# EAGLE design imu_b_03_12_2018 (EAGLE 6.6.0)
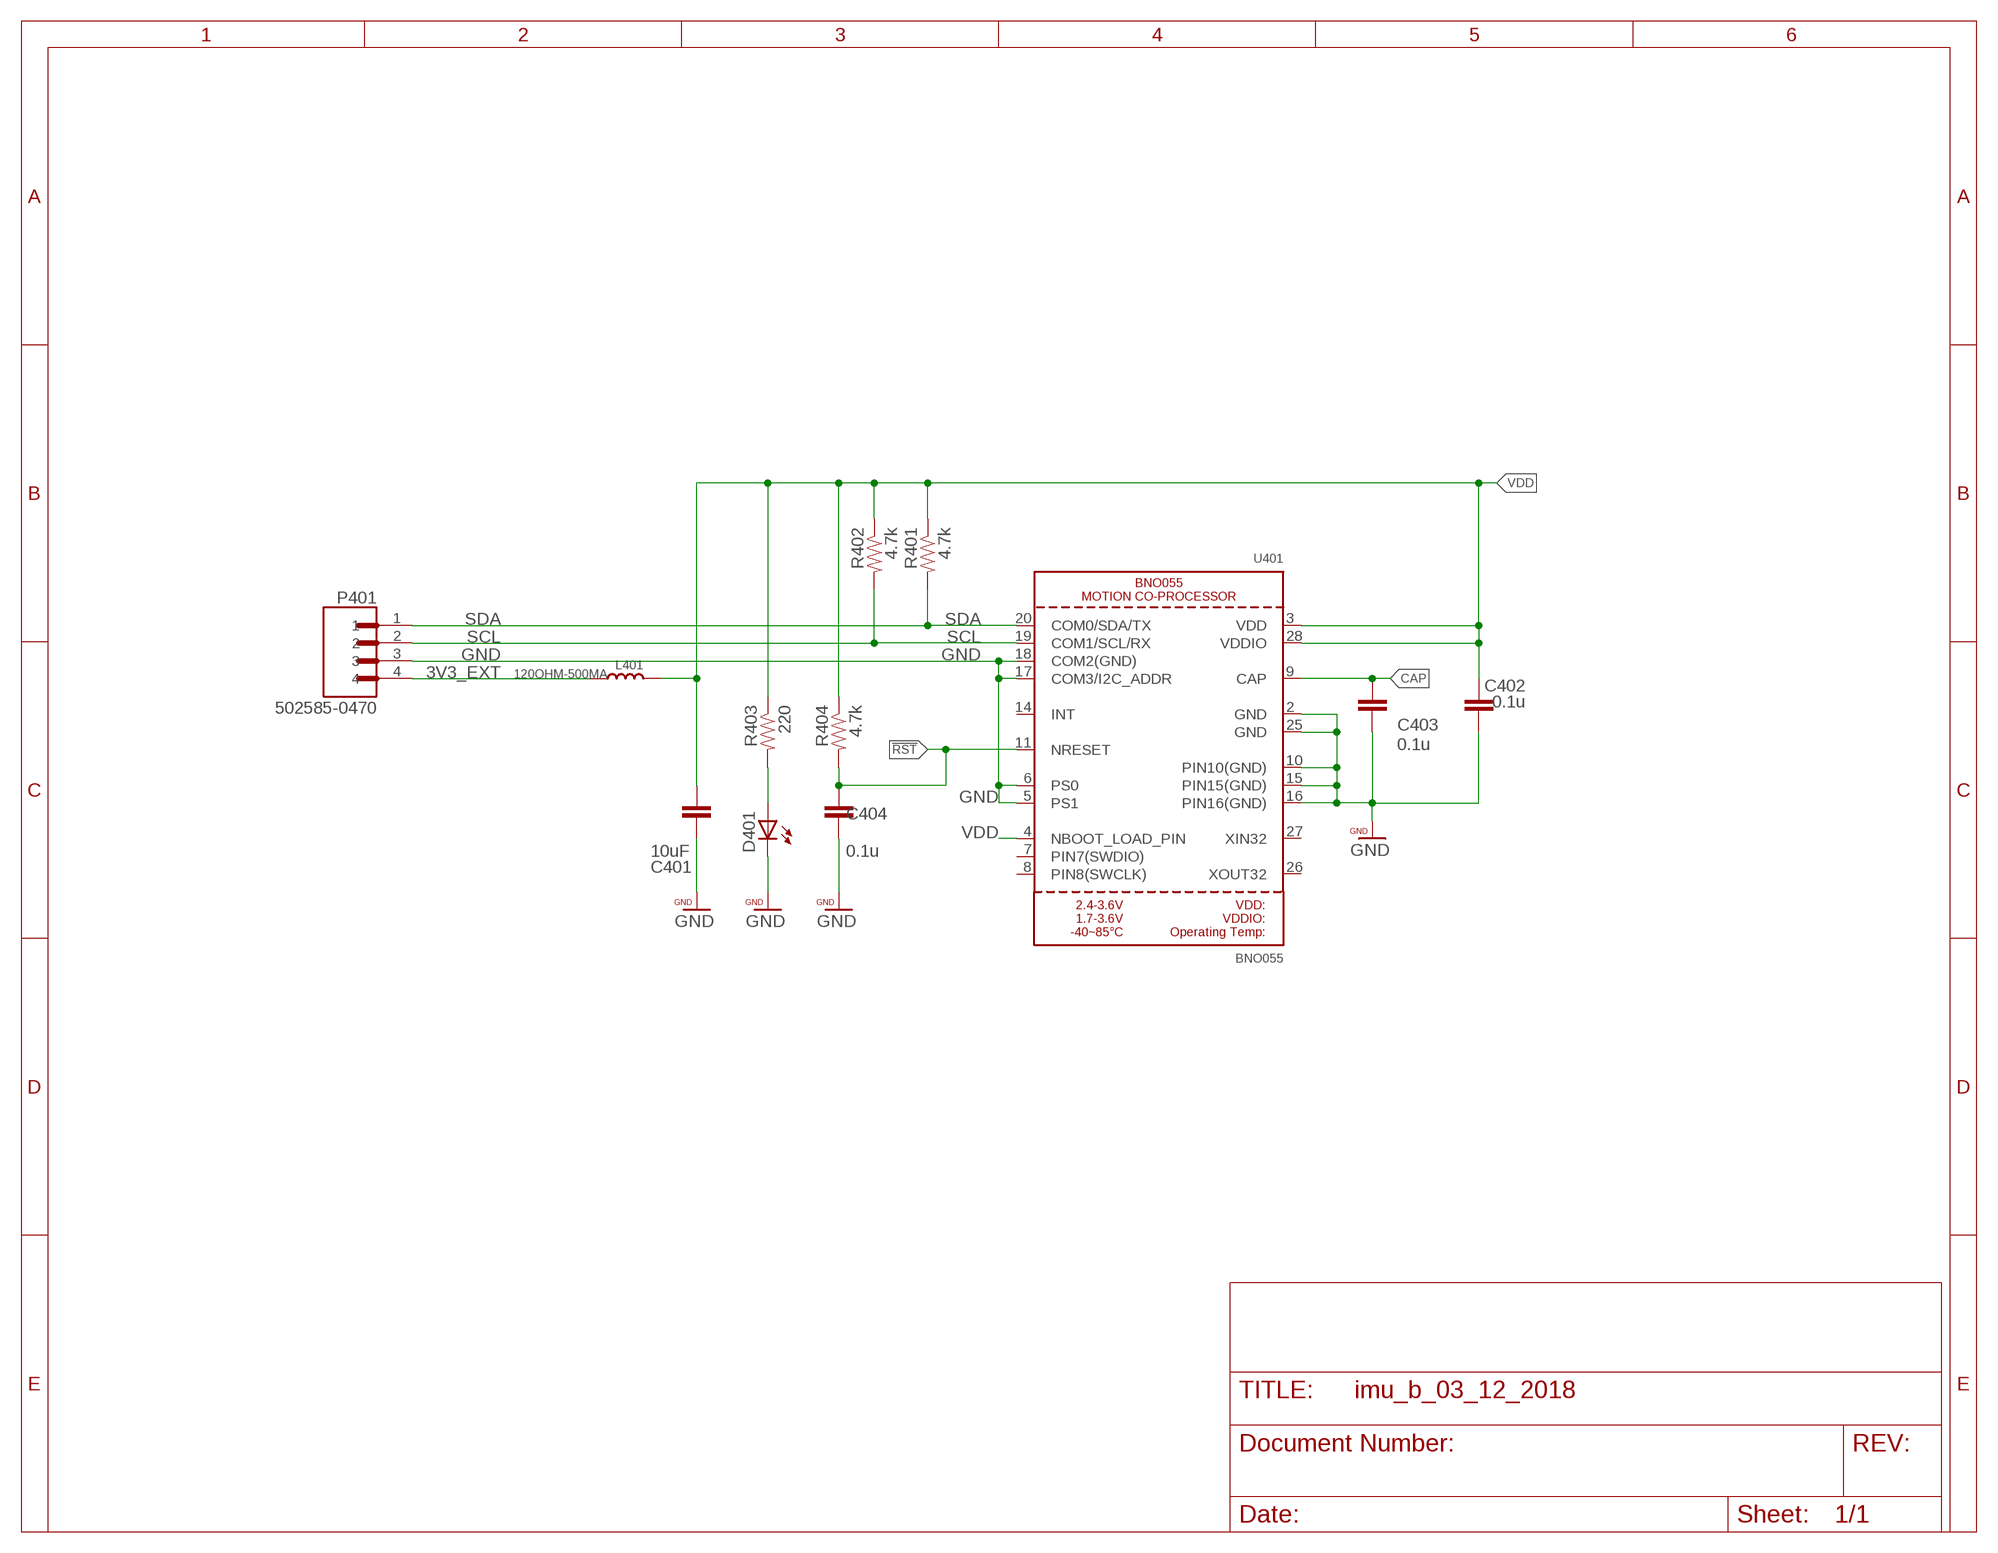
[diagram p0: schematic, sheet 1]

## Parts
C401  10uF  CAP0402-CAP  [0402-CAP]
C402  0.1u  CAP0402-CAP  [0402-CAP]
C403  0.1u  CAP0402-CAP  [0402-CAP]
C404  0.1u  CAP0402-CAP  [0402-CAP]
D401  LEDCHIP-LED0603  [CHIP-LED0603]
L401  120OHM-500MA  SMD-FERRITE-CHIP-120-OHM-500MA(0603)  [L0603]
P401  502585-0470  [MOLEX_502585-0470]
R401  4.7k  RESISTOR0402-TYP  [EIA-0402]
R402  4.7k  RESISTOR0402-TYP  [EIA-0402]
R403  220  RESISTOR0402-TYP  [EIA-0402]
R404  4.7k  RESISTOR0402-TYP  [EIA-0402]
U401  BNO055  [BNO055]

## Nets
3V3_EXT: L401.2 P401.4
!RST: C404.1 R404.2 U401.11(NRESET)
CAP: C403.1 U401.9(CAP)
GND: C401.2 C402.2 C403.2 C404.2 D401.C P401.3 U401.2(GND) U401.5(PS1) U401.6(PS0) U401.10(PIN10(GND)) U401.15(PIN15(GND)) U401.16(PIN16(GND)) U401.17(COM3/I2C_ADDR) U401.18(COM2(GND)) U401.25(GND)
N$2: D401.A R403.2
SCL: P401.2 R402.2 U401.19(COM1/SCL/RX)
SDA: P401.1 R401.2 U401.20(COM0/SDA/TX)
VDD: C401.1 C402.1 L401.1 R401.1 R402.1 R403.1 R404.1 U401.3(VDD) U401.4(NBOOT_LOAD_PIN) U401.28(VDDIO)
Unconnected: U401.7(PIN7(SWDIO)) U401.8(PIN8(SWCLK)) U401.14(INT) U401.26(XOUT32) U401.27(XIN32)

## Library data of the parts
C401-C404 = PatternAgents-ProtoPads:CAP: Capacitor Standard 0603 ceramic capacitor, and 0.1" leaded capacitor.
D401 = led:LED: LED OSRAM: - CHIPLED LG R971, LG N971, LY N971, LG Q971, LY Q971, LO R971, LY R971 LH N974, LH R974 LS Q976, LO Q976, LY Q976 LO Q996 - Hyper CHIPLED LW Q18S LB Q993, LB Q99A, LB R99A - SideLED LS A670, LO A670, LY A670, LG A670, LP A670 LB A673, LV A673, LT A673, LW A673 LH A674 LY A675 LS A676, LA A676, LO A676, LY A676, LW A676 LS A679, LY A679, LG A679 - Hyper Micro SIDELED® LS Y876, LA Y876, LO Y876, LY Y876 LT Y87S - SmartLED LW L88C, LW L88S LB L89C, LB L89S, LG L890 LS L89K, LO L89K, LY L89K LS L896, LA L896, LO L896, LY L896 - TOPLED LS T670, LO T670, LY T670, LG T670, LP T670 LSG T670, LSP T670, LSY T670, LOP T670, LYG T670 LG T671, LOG T671, LSG T671 LB T673, LV T673, LT T673, LW T673 LH T674 LS T676, LA T676, LO T676, LY T676, LB T676, LH T676, LSB T676, LW T676 LB T67C, LV T67C, LT T67C, LS T67K, LO T67K, LY T67K, LW E67C LS E67B, LA E67B, LO E67B, LY E67B, LB E67C, LV E67C, LT E67C LW T67C LS T679, LY T679, LG T679 LS T770, LO T770, LY T770, LG T770, LP T770 LB T773, LV T773, LT T773, LW T773 LH T774 LS E675, LA E675, LY E675, LS T675 LS T776, LA T776, LO T776, LY T776, LB T776 LHGB T686 LT T68C, LB T68C - Hyper Mini TOPLED® LB M676 - Mini TOPLED Santana® LG M470 LS M47K, LO M47K, LY M47K Source: http://www.osram.convergy.de LUXEON: - LUMILED® LXK2-PW12-R00, LXK2-PW12-S00, LXK2-PW14-U00, LXK2-PW14-V00 LXK2-PM12-R00, LXK2-PM12-S00, LXK2-PM14-U00 LXK2-PE12-Q00, LXK2-PE12-R00, LXK2-PE12-S00, LXK2-PE14-T00, LXK2-PE14-U00 LXK2-PB12-K00, LXK2-PB12-L00, LXK2-PB12-M00, LXK2-PB14-N00, LXK2-PB14-P00, LXK2-PB14-Q00 LXK2-PR12-L00, LXK2-PR12-M00, LXK2-PR14-Q00, LXK2-PR14-R00 LXK2-PD12-Q00, LXK2-PD12-R00, LXK2-PD12-S00 LXK2-PH12-R00, LXK2-PH12-S00 LXK2-PL12-P00, LXK2-PL12-Q00, LXK2-PL12-R00 Source: www.luxeon.com KINGBRIGHT: KA-3528ASYC Source: www.kingbright.com
L401 = halcyonmod_Passives:SMD-FERRITE-CHIP-120-OHM-500MA(0603): 303030001; MPN: BLM18AG121SN1D
P401 = 502585-0470:502585-0470: 1.50mm Pitch CLIK-Mate™ Wire-to-Board PCB Receptacle, Single Row, Right Angle, 4 Circuits; AVAILABILITY: Good; DESCRIPTION: 1.50mm Pitch CLIK-Mate™ Wire-to-Board PCB Receptacle, Single Row, Right Angle, 4 Circuits; MF: Molex; MP: 502585-0470; PACKAGE: None; PRICE: 0.44 USD
R401-R404 = PatternAgents-ProtoPads:RESISTOR: Resistor Basic schematic elements and footprints for 0603, 1206, and PTH resistors.
U401 = microbuilder:BNO055: BNO055 - Motion Co-Processor

## Board
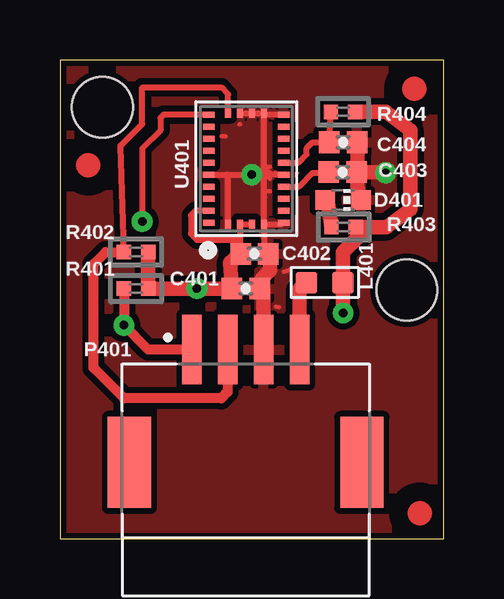
[diagram p1: board, top side]
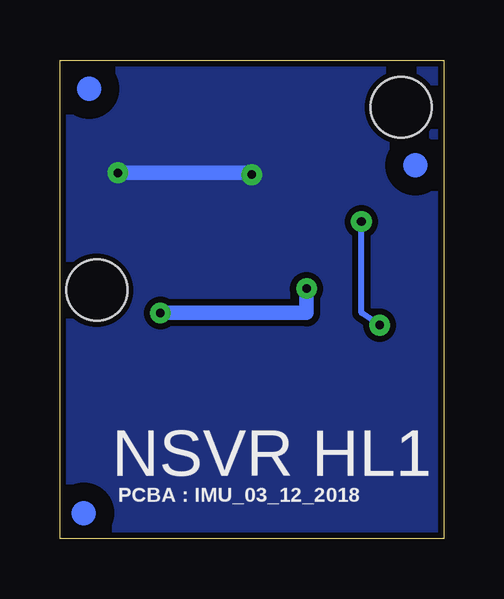
[diagram p2: board, bottom side, seen from below]

Size 16 x 19.94 mm. Coordinates in mm from the lower left corner, seen from the top.
Outline: 0,0 16,0 16,19.94 0,19.94 0,0
Copper layers (1*16): Top 0.035mm / dielectric 1.5mm / Bottom 0.035mm
Design rules "PatternAgents_7mil": minimum track width 7mil, minimum drill 14mil, track to track 7mil, track to pad 7mil, pad to pad 7mil, via to via 7mil, smd to smd 7mil, copper to edge 7mil, drill to drill 7mil, minimum pad ring 12mil, minimum via ring 10mil, stop-mask expansion 4mil, vias tented up to drill 25mil, thermal gap 7mil
Holes 2.54 mm at 14.47,10.35 1.77,17.97

### Footprints (pad centres in the part's own frame; a part is rotated, then mirrored left to right if it is on the bottom)
0402-CAP = smd 0.85 x 0.9: 1 -0.58,0; 2 0.58,0
CHIP-LED0603 = smd 0.8 x 0.8: A 0,-0.75; C 0,0.75
L0603 = smd 0.889 x 0.889: 1 -0.762,0; 2 0.762,0
MOLEX_502585-0470 = smd 0.8 x 2.9: 1 -2.25,0; 2 -0.75,0; 3 0.75,0; 4 2.25,0 | smd 1.8 x 3.8: P1 -4.85,-4.7; P2 4.85,-4.7
EIA-0402 = smd 0.6 x 0.6: 1 -0.508,0; 2 0.508,0
BNO055 = smd 0.25 x 0.475: 1 -2.25,1.562; 6 -2.25,-1.562; 7 -1.75,-1.562; 8 -1.25,-1.562; 9 -0.75,-1.562; 10 -0.25,-1.562; 11 0.25,-1.562; 12 0.75,-1.562; 13 1.25,-1.562; 14 1.75,-1.562; 15 2.25,-1.562; 20 2.25,1.562; 21 1.75,1.562; 22 1.25,1.562; 23 0.75,1.562; 24 0.25,1.562; 25 -0.25,1.562; 26 -0.75,1.562; 27 -1.25,1.562; 28 -1.75,1.562 | smd 0.375 x 0.25: 2 -2.312,0.75; 3 -2.312,0.25; 4 -2.312,-0.25; 5 -2.312,-0.75; 16 2.312,-0.75; 17 2.312,-0.25; 18 2.312,0.25; 19 2.312,0.75

### Placement (x,y rotation side)
$$U$2  [CIRCLE-1MM-2R]  1.18,15.56 0 top
C401  7.75,10.41 0 top
C402  8.11,11.86 0 top
C403  11.79,15.27 0 top
C404  11.81,16.51 0 top
D401  11.81,14.11 270 top
L401  11.05,10.67 180 top
P401  7.75,7.87 0 top
R401  3.17,10.41 180 top
R402  3.17,11.94 180 top
R403  11.83,12.98 180 top
R404  11.81,17.78 180 top
U401  7.77,15.41 90 top
U$1  [CIRCLE-1MM-2R]  15,1.06 0 top
U$3  [CIRCLE-1MM-2R]  14.78,18.74 0 top

### Tracks (layer width: path | path; a pad name or v marks a point on that pad's centre or on a via)
3V3_EXT
  Top 0.61: P401.4 10,10.38 L401.2
!RST
  Top 0.254: U401.11 9.94,15.66 10.29,16 10.29,16.26 10.54,16.51 C404.1 R404.2
CAP
  Top 0.254: U401.9 9.96,14.66 10.54,15.24 11.11,15.24 C403.1
GND  (via drill 0.36)
  Top 0.178: 8.51,14.22 8.52,14.22 | 8.76,14.99 8.71,15.16 | 7.49,17.27 7.52,17.26 | 6.73,16.76 6.9,16.76 | 8.76,14.48 8.64,14.48 | 8.76,15.24 8.64,15.34 | 9.02,15.24 8.82,15.16 | 8.76,15.49 8.64,15.49 | 8.51,10.41 C401.2 8.26,10.41 C401.2 | 9.53,11.18 9.35,11.11 | 9.02,9.65 9.13,9.63
  Top 0.254: U401.5 8.52,12.11 C402.2 | U401.5 9.27,13.1 U401.6 | U401.5 8.52,14.22 8.52,14.99 | 8.52,14.99 8.52,15.24 | 8.52,15.24 U401.16 | U401.25 6.98,15.16 | 6.98,15.16 v8,15.16 8.44,15.16 8.52,15.24 | U401.10 8.69,15.16 8.52,14.99 | U401.2 7.02,15.12 6.98,15.16 | U401.18 U401.17 U401.16 | U401.15 8.58,17.66 U401.16
  Top 0.61: P401.3 8.5,10.31 C401.2 8.4,10.81 8.76,11.18 8.76,11.86 C402.2 | C403.2 12.44,16.49 C404.2 | C403.2 12.44,14.23 D401.C | C403.2 13.56,15.27 v13.59,15.24
  Bottom 0.61: v13.59,15.24 8.08,15.24 v8,15.16
  pour Top (isolate 0.254): -0.13,20.07 16.13,20.07 16.13,0 -0.13,0
  pour Bottom (isolate 0.254): -0.13,20.07 16.13,20.07 16.13,0 -0.13,0
N$2
  Top 0.61: R403.2 11.18,13.99 D401.A
SCL
  Top 0.254: R402.2 2.53,16.37 3.43,17.27 3.43,18.8 6.73,18.8 7.02,18.51 U401.19
  Top 0.406: P401.2 7,6.11 6.73,5.84 2.67,5.84 1.4,7.11 1.4,11.43 1.91,11.94 R402.2
SDA  (via drill 0.36)
  Top 0.254: U401.20 4.32,17.66 4.19,17.53 4.19,17.02 3.43,16.26 v3.43,13.21
  Top 0.406: P401.1 3.68,7.87 v2.67,8.89 R401.2
  Bottom 0.254: v2.67,8.89 3.43,9.4 v3.43,13.21
VDD  (via drill 0.36)
  Top 0.254: 7.52,12.45 U401.3 U401.4 | 7.52,12.45 7.52,11.92 C402.1 | U401.28 5.66,13.66 5.46,13.46 5.46,12.7 5.71,12.45 7.52,12.45
  Top 0.61: R402.1 R401.1 v5.71,10.41 C401.1 7.1,11.5 C402.1 | v11.81,9.4 L401.1 11.81,11.94 12.48,12.61 R403.1 13.61,12.98 14.61,13.72 14.61,17.02 13.59,17.78 R404.1
  Bottom 0.61: v5.71,10.41 5.71,9.4 v11.81,9.4

### Text on the board
bPlace: PCBA : IMU_03_12_2018
bNames: NSVR HL1